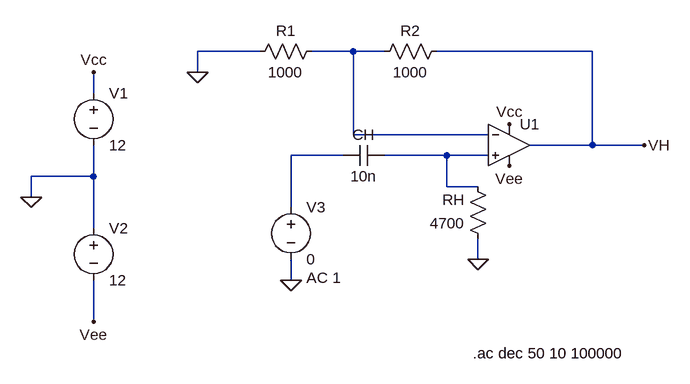
[diagram p0: schematic Draft4.asc]
Draft4.asc, the LTspice schematic file:
Version 4
SHEET 1 1012 680
WIRE 368 -64 272 -64
WIRE 512 -64 448 -64
WIRE 560 -64 512 -64
WIRE 880 -64 640 -64
WIRE 272 -32 272 -64
WIRE 112 0 112 -32
WIRE 512 64 512 -64
WIRE 720 64 512 64
WIRE 880 80 880 -64
WIRE 880 80 784 80
WIRE 960 80 880 80
WIRE 496 96 416 96
WIRE 656 96 560 96
WIRE 720 96 656 96
WIRE 112 128 112 80
WIRE 112 128 16 128
WIRE 656 144 656 96
WIRE 704 144 656 144
WIRE 16 160 16 128
WIRE 416 176 416 96
WIRE 112 208 112 128
WIRE 704 256 704 224
WIRE 416 288 416 256
WIRE 112 352 112 288
FLAG 416 288 0
FLAG 16 160 0
FLAG 272 -32 0
FLAG 704 256 0
FLAG 112 -32 Vcc
FLAG 112 352 Vee
FLAG 752 112 Vee
FLAG 752 48 Vcc
FLAG 960 80 VH
SYMBOL voltage 112 -16 R0
WINDOW 123 0 0 Left 0
WINDOW 39 0 0 Left 0
SYMATTR InstName V1
SYMATTR Value 12
SYMBOL voltage 112 192 R0
WINDOW 123 0 0 Left 0
WINDOW 39 0 0 Left 0
SYMATTR InstName V2
SYMATTR Value 12
SYMBOL voltage 416 160 R0
WINDOW 123 24 124 Left 2
WINDOW 39 0 0 Left 0
SYMATTR Value2 AC 1
SYMATTR InstName V3
SYMATTR Value 0
SYMBOL res 464 -80 R90
WINDOW 0 0 56 VBottom 2
WINDOW 3 32 56 VTop 2
SYMATTR InstName R1
SYMATTR Value 1000
SYMBOL res 656 -80 R90
WINDOW 0 0 56 VBottom 2
WINDOW 3 32 56 VTop 2
SYMATTR InstName R2
SYMATTR Value 1000
SYMBOL res 720 240 R180
WINDOW 0 36 76 Left 2
WINDOW 3 36 40 Left 2
SYMATTR InstName RH
SYMATTR Value 4700
SYMBOL cap 560 80 R90
WINDOW 0 0 32 VBottom 2
WINDOW 3 32 32 VTop 2
SYMATTR InstName CH
SYMATTR Value 10n
SYMBOL OpAmps\\UniversalOpamp2 752 80 R0
SYMATTR InstName U1
TEXT 696 400 Left 2 !.ac dec 50 10 100000

The netlist it stands for:
* Draft4.asc
V1 Vcc 0 12
V2 0 Vee 12
V3 N002 0 0 AC 1
R1 N001 0 1000
R2 VH N001 1000
RH 0 N003 4700
CH N003 N002 10n
XU1 N003 N001 Vcc Vee VH level.2 Avol=1Meg GBW=10Meg Slew=10Meg ilimit=25m rail=0 Vos=0 phimargin=45 en=0 enk=0 in=0 ink=0 Rin=500Meg  ; pins IN+ IN- V+ V- OUT
.ac dec 50 10 100000
.lib UniversalOpamps2.sub
.backanno
.end